# EAGLE schematic Pro Trinket Keyboard V4.0 (EAGLE 7.4.0)
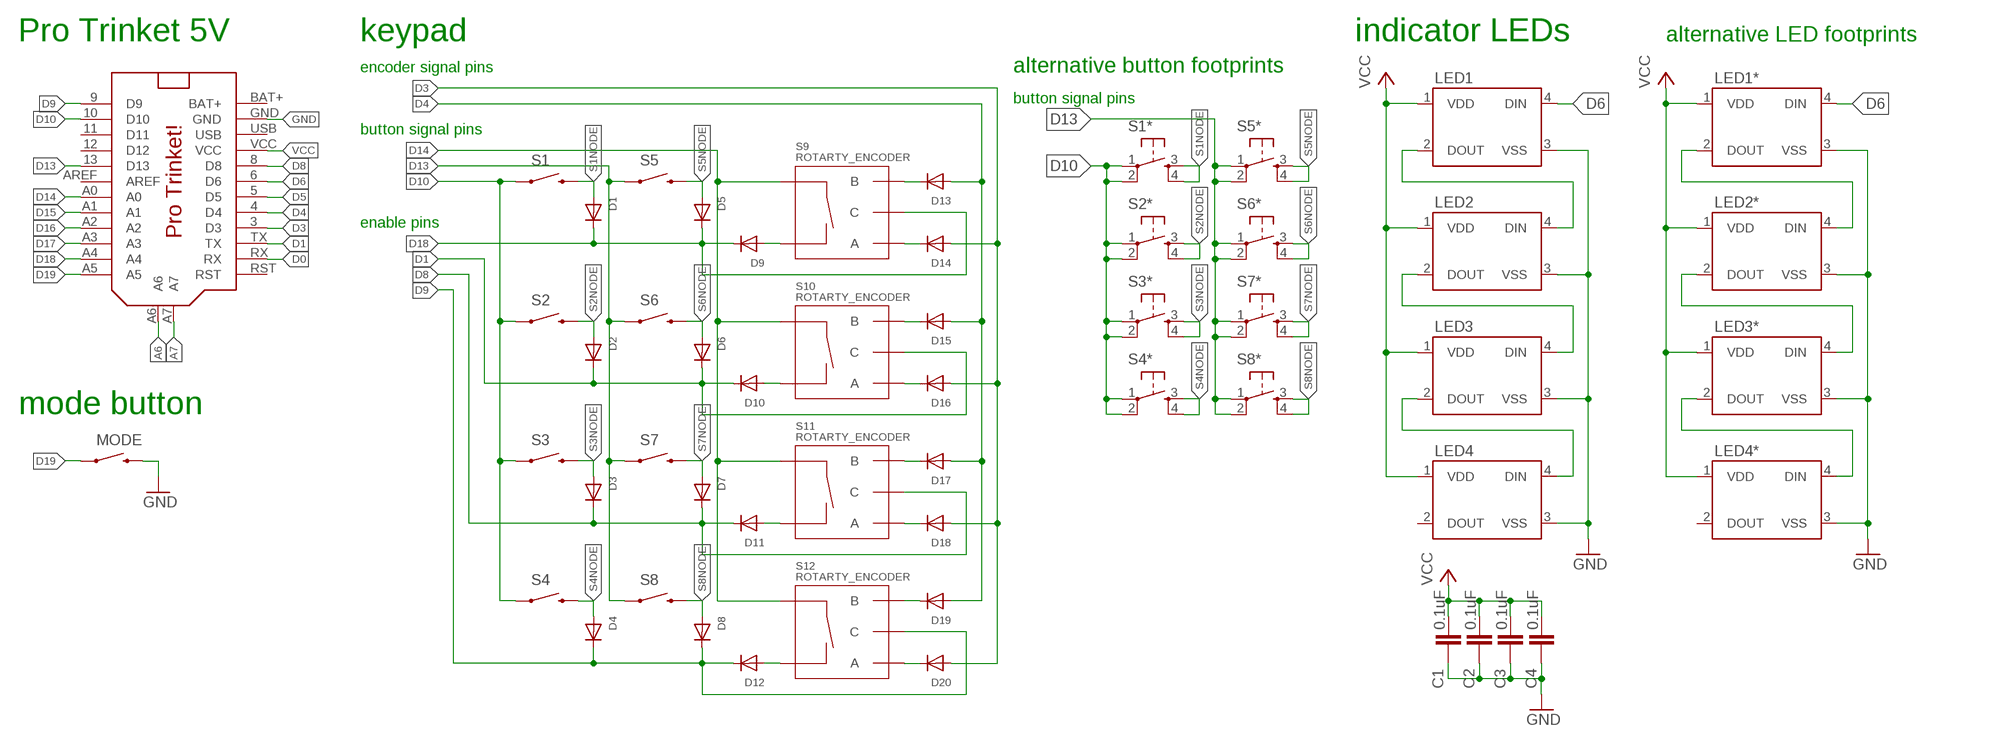
[diagram p0: schematic, sheet 1]

## Parts
C1  0.1uF  22PF-50V-5%(0603)  [0603-CAP]
C2  0.1uF  22PF-50V-5%(0603)  [0603-CAP]
C3  0.1uF  22PF-50V-5%(0603)  [0603-CAP]
C4  0.1uF  22PF-50V-5%(0603)  [0603-CAP]
D1  DIODESOD-123  [SOD-123]
D2  DIODESOD-123  [SOD-123]
D3  DIODESOD-123  [SOD-123]
D4  DIODESOD-123  [SOD-123]
D5  DIODESOD-123  [SOD-123]
D6  DIODESOD-123  [SOD-123]
D7  DIODESOD-123  [SOD-123]
D8  DIODESOD-123  [SOD-123]
D9  DIODESOD-123  [SOD-123]
D10  DIODESOD-123  [SOD-123]
D11  DIODESOD-123  [SOD-123]
D12  DIODESOD-123  [SOD-123]
D13  DIODESOD-123  [SOD-123]
D14  DIODESOD-123  [SOD-123]
D15  DIODESOD-123  [SOD-123]
D16  DIODESOD-123  [SOD-123]
D17  DIODESOD-123  [SOD-123]
D18  DIODESOD-123  [SOD-123]
D19  DIODESOD-123  [SOD-123]
D20  DIODESOD-123  [SOD-123]
LED1  WS2812B  [WS2812B]
LED1*  WS2812B  [WS2812B]
LED2  WS2812B  [WS2812B]
LED2*  WS2812B  [WS2812B]
LED3  WS2812B  [WS2812B]
LED3*  WS2812B  [WS2812B]
LED4  WS2812B  [WS2812B]
LED4*  WS2812B  [WS2812B]
MODE  SWITCH-MOMENTARY-2SIDE_EZ  [TACTILE-PTH-SIDEEZ]
PRO_TRINKET  PRO_TRINKET  [PROTRINKET]
S1  SWITCH-MOMENTARY-212MM  [TACTILE-PTH-12MM]
S1*  TACTILE-SWITCH-PTH  [TAC-SWITCH-PTH]
S2  SWITCH-MOMENTARY-212MM  [TACTILE-PTH-12MM]
S2*  TACTILE-SWITCH-PTH  [TAC-SWITCH-PTH]
S3  SWITCH-MOMENTARY-212MM  [TACTILE-PTH-12MM]
S3*  TACTILE-SWITCH-PTH  [TAC-SWITCH-PTH]
S4  SWITCH-MOMENTARY-212MM  [TACTILE-PTH-12MM]
S4*  TACTILE-SWITCH-PTH  [TAC-SWITCH-PTH]
S5  SWITCH-MOMENTARY-212MM  [TACTILE-PTH-12MM]
S5*  TACTILE-SWITCH-PTH  [TAC-SWITCH-PTH]
S6  SWITCH-MOMENTARY-212MM  [TACTILE-PTH-12MM]
S6*  TACTILE-SWITCH-PTH  [TAC-SWITCH-PTH]
S7  SWITCH-MOMENTARY-212MM  [TACTILE-PTH-12MM]
S7*  TACTILE-SWITCH-PTH  [TAC-SWITCH-PTH]
S8  SWITCH-MOMENTARY-212MM  [TACTILE-PTH-12MM]
S8*  TACTILE-SWITCH-PTH  [TAC-SWITCH-PTH]
S9  ROTARTY_ENCODER  [ROTARY_ENC_PLAIN]
S10  ROTARTY_ENCODER  [ROTARY_ENC_PLAIN]
S11  ROTARTY_ENCODER  [ROTARY_ENC_PLAIN]
S12  ROTARTY_ENCODER  [ROTARY_ENC_PLAIN]

## Nets
A6: PRO_TRINKET.A6
A7: PRO_TRINKET.A7
D0: PRO_TRINKET.RX
D1: D2.C D6.C D10.C PRO_TRINKET.TX S10.C
D3: D14.A D16.A D18.A D20.A PRO_TRINKET.3(D3)
D4: D13.A D15.A D17.A D19.A PRO_TRINKET.4(D4)
D5: PRO_TRINKET.5(D5)
D6: LED1*.4(DIN) LED1.4(DIN) PRO_TRINKET.6(D6)
D8: D3.C D7.C D11.C PRO_TRINKET.8(D8) S11.C
D9: D4.C D8.C D12.C PRO_TRINKET.9(D9) S12.C
D10: PRO_TRINKET.10(D10) S1*.1 S1*.2 S1.1 S1.2 S2*.1 S2*.2 S2.1 S2.2 S3*.1 S3*.2 S3.1 S3.2 S4*.1 S4*.2 S4.1 S4.2
D13: PRO_TRINKET.13(D13) S5*.1 S5*.2 S5.1 S5.2 S6*.1 S6*.2 S6.1 S6.2 S7*.1 S7*.2 S7.1 S7.2 S8*.1 S8*.2 S8.1 S8.2
D14: PRO_TRINKET.A0 S9.SW+ S10.SW+ S11.SW+ S12.SW+
D15: PRO_TRINKET.A1
D16: PRO_TRINKET.A2
D17: PRO_TRINKET.A3
D18: D1.C D5.C D9.C PRO_TRINKET.A4 S9.C
D19: MODE.1 PRO_TRINKET.A5
GND: C1.1 C2.1 C3.1 C4.1 LED1*.3(VSS) LED1.3(VSS) LED2*.3(VSS) LED2.3(VSS) LED3*.3(VSS) LED3.3(VSS) LED4*.3(VSS) LED4.3(VSS) MODE.2 PRO_TRINKET.GND
L1NODE: LED1*.2(DOUT) LED1.2(DOUT) LED2*.4(DIN) LED2.4(DIN)
L2NODE: LED2*.2(DOUT) LED2.2(DOUT) LED3*.4(DIN) LED3.4(DIN)
L3NODE: LED3*.2(DOUT) LED3.2(DOUT) LED4*.4(DIN) LED4.4(DIN)
N$34: D10.A S10.SW-
N$35: D9.A S9.SW-
N$36: D11.A S11.SW-
N$37: D20.C S12.A
N$38: D19.C S12.B
N$39: D18.C S11.A
N$40: D12.A S12.SW-
N$41: D16.C S10.A
N$42: D15.C S10.B
N$43: D14.C S9.A
N$44: D13.C S9.B
N$45: D17.C S11.B
S1NODE: D1.A S1*.3 S1*.4 S1.3 S1.4
S2NODE: D2.A S2*.3 S2*.4 S2.3 S2.4
S3NODE: D3.A S3*.3 S3*.4 S3.3 S3.4
S4NODE: D4.A S4*.3 S4*.4 S4.3 S4.4
S5NODE: D5.A S5*.3 S5*.4 S5.3 S5.4
S6NODE: D6.A S6*.3 S6*.4 S6.3 S6.4
S7NODE: D7.A S7*.3 S7*.4 S7.3 S7.4
S8NODE: D8.A S8*.3 S8*.4 S8.3 S8.4
VCC: C1.2 C2.2 C3.2 C4.2 LED1*.1(VDD) LED1.1(VDD) LED2*.1(VDD) LED2.1(VDD) LED3*.1(VDD) LED3.1(VDD) LED4*.1(VDD) LED4.1(VDD) PRO_TRINKET.VCC
Unconnected: LED4*.2(DOUT) LED4.2(DOUT) PRO_TRINKET.11(D11) PRO_TRINKET.12(D12) PRO_TRINKET.AREF PRO_TRINKET.RST

## Notes on the sheet
- Pro Trinket 5V | keypad | indicator LEDs | alternative LED footprints
- encoder signal pins | alternative button footprints
- button signal pins
- button signal pins
- enable pins
- mode button

## Power pins joined to a net without a drawn wire
BAT+: PRO_TRINKET.BAT+
USB: PRO_TRINKET.USB

## Library data of the parts
C1-C4 = SparkFun-Capacitors:22PF-50V-5%(0603): CAP-07876; PROD_ID: CAP-07876; VALUE: 22pF
D1-D20 = adafruit:DIODE: Diode SMADIODE - SMA Surface Mount Package 20V 1A Schottky Diode Digikey: 641-1014-6-ND DO-1N4148 - Through Hole Small Current Diode SOD-123 20V 1 A (.5mV Vf) Schottky Diode - Digikey: MBRX120TPMSCT-ND SOD-323 10V 570mA (.38mV Vf, 3ns) Schottky Diode - Digikey: ZLLS410CT-ND SOD-523 30V 30mA Schottky Diode (RB751S-40TE61) - Digikey: RB751S-40TE61CT-ND SOT23-R/W - SOT23 Package (R = Solder Paste/Reflow Ovens, W = Hand-Soldering) BAT54Film 40V 300mA - Digikey: 497-7162-1-ND
LED1 LED1* LED2 LED2* LED3 LED3* LED4 LED4* = SparkFun-LED:WS2812B: WS2812B - Intelligent control LED integrated light source Technical Specifications: Power Supply Voltage (VDD): 3.5 to 5.3 V Input Voltage (VI): -0.5 to VDD+0.5 V Operating Junction Temperature (Topt): -25°C to +80°C Storage Temperature Range (Tstg): -55°C to +150°C
MODE = SparkFun-Electromechanical:SWITCH-MOMENTARY-2: Various NO switches- pushbuttons, reed, etc
PRO_TRINKET = adafruit:PRO_TRINKET
S1-S8 = SparkFun-Electromechanical:SWITCH-MOMENTARY-2: Various NO switches- pushbuttons, reed, etc; PROD_ID: SWCH-09185
S1* S2* S3* S4* S5* S6* S7* S8* = GeekAmmo:TACTILE-SWITCH: Tactile Switch 4 Pins, SPST NO
S9-S12 = SparkFun-Electromechanical:ROTARTY_ENCODER: Simple no LED rotary encoder Example: COM-09117